# EAGLE design OV3660 3M Camera for Home Assistant V1.1 (EAGLE 6.1)
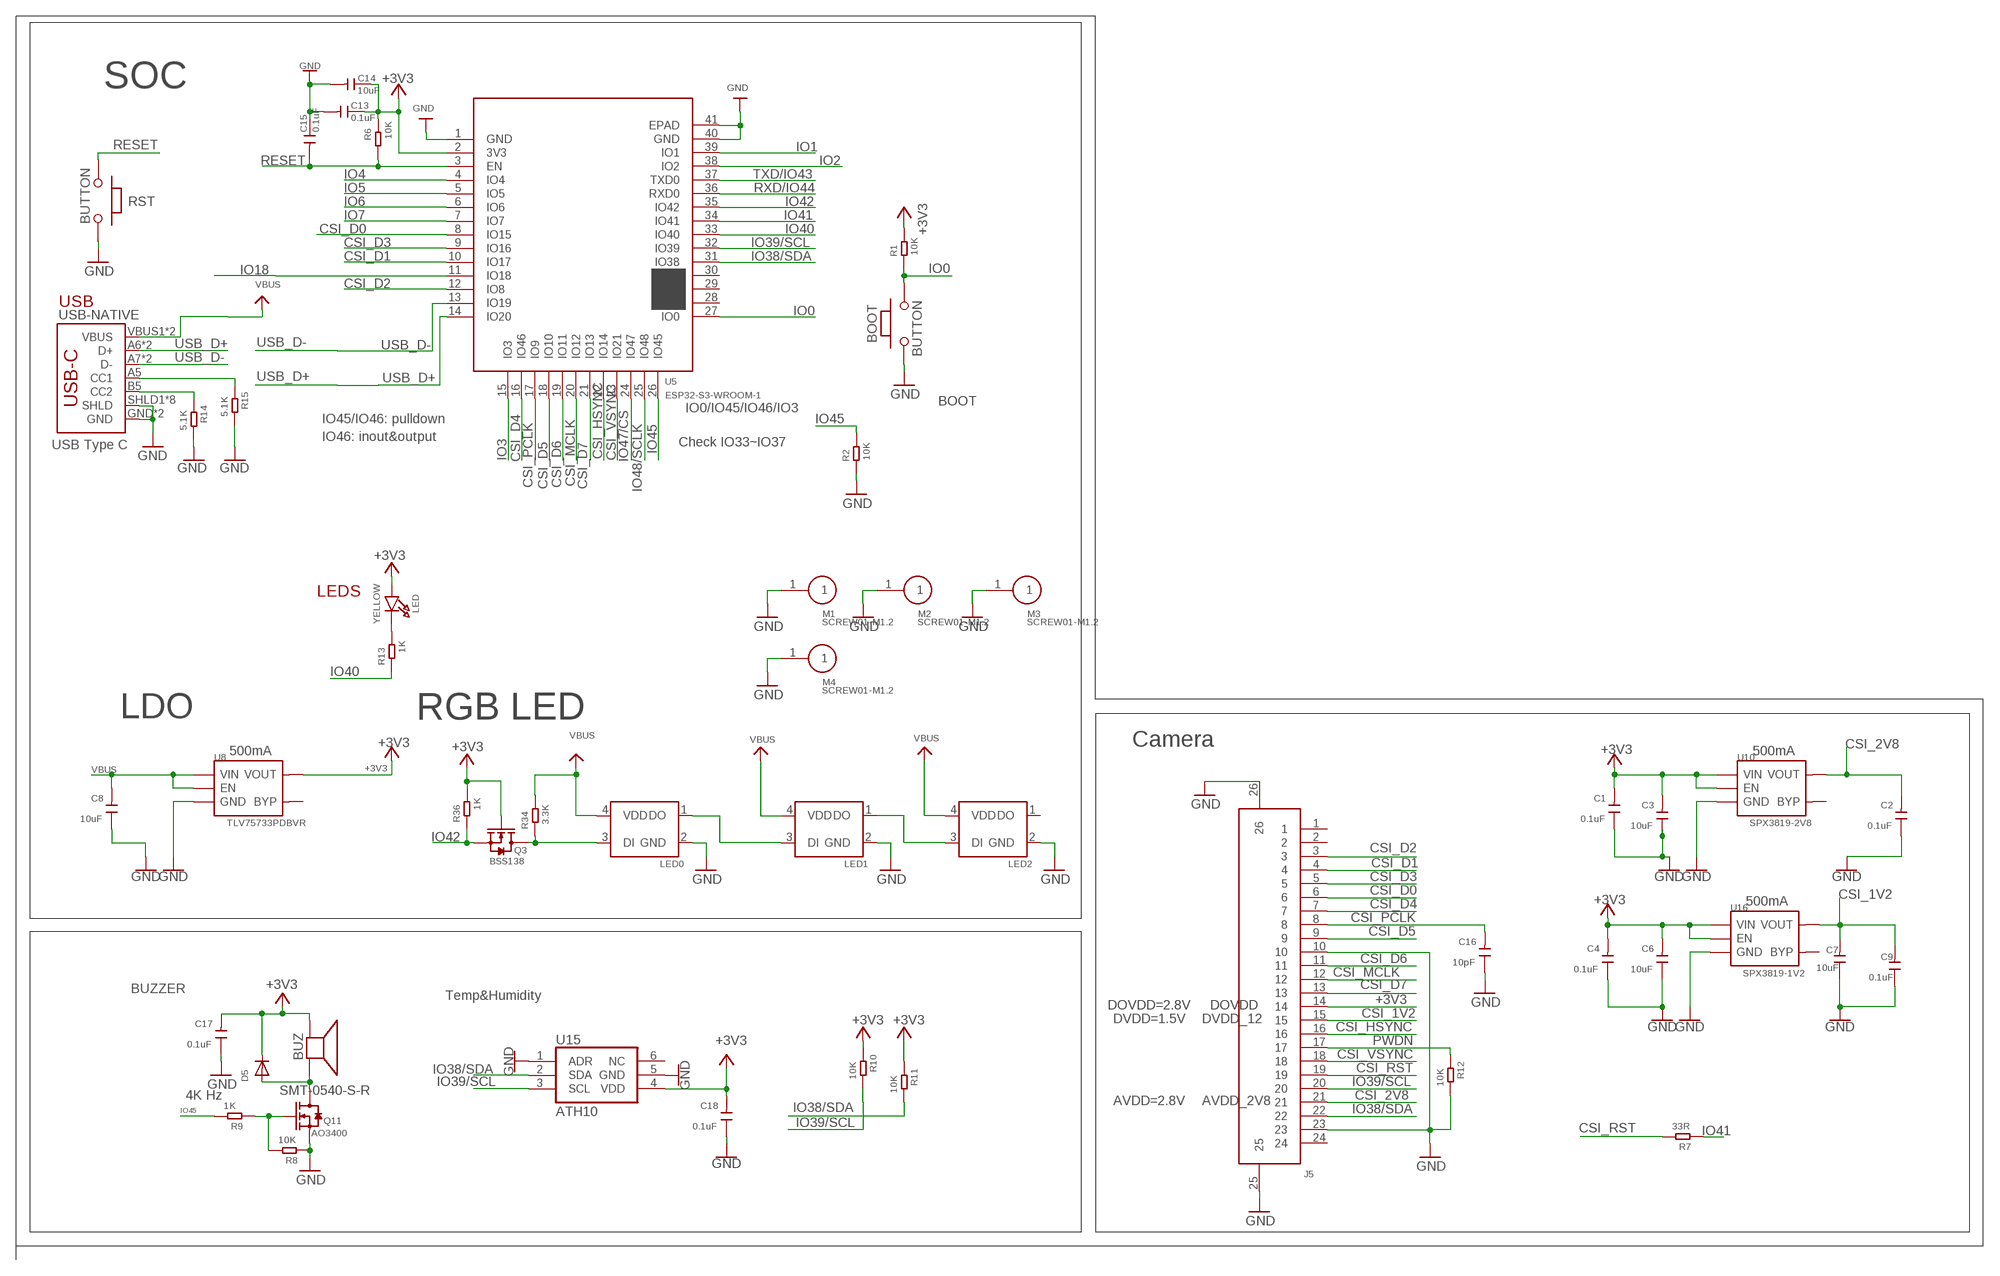
[diagram p0: schematic, sheet 1]

## Parts
BOOT  BUTTON  PB157  [157SW]
BUZ  SMT-0540-S-R  [SMT-0540-S-R]
C1  0.1uF  DISCRETE_C-0402  [DISCRETE_C0402]
C2  0.1uF  DISCRETE_C-0402  [DISCRETE_C0402]
C3  10uF  DISCRETE_C-0402  [DISCRETE_C0402]
C4  0.1uF  DISCRETE_C-0402  [DISCRETE_C0402]
C6  10uF  DISCRETE_C-0402  [DISCRETE_C0402]
C7  10uF  DISCRETE_C-0402  [DISCRETE_C0402]
C8  10uF  DISCRETE_C-0402  [DISCRETE_C0402]
C9  0.1uF  DISCRETE_C-0402  [DISCRETE_C0402]
C13  0.1uF  DISCRETE_C-0402  [DISCRETE_C0402]
C14  10uF  DISCRETE_C-0402  [DISCRETE_C0402]
C15  0.1uF  DISCRETE_C-0402  [DISCRETE_C0402]
C16  10pF  DISCRETE_C-0402  [DISCRETE_C0402]
C17  0.1uF  DISCRETE_C-0402  [DISCRETE_C0402]
C18  0.1uF  DISCRETE_C-0402  [DISCRETE_C0402]
D5  DIODESOD-323F  [SOD-323F]
J5  FPC-24P  [SMD26-50P-1760L450W]
LED  YELLOW  LED0805_NOOUTLINE  [CHIPLED_0805_NOOUTLINE]
LED0  WS2812B-2020  [WS2812B-2020]
LED1  WS2812B-2020  [WS2812B-2020]
LED2  WS2812B-2020  [WS2812B-2020]
M1  SCREW01-M1.2  [THD1-M1.2]
M2  SCREW01-M1.2  [THD1-M1.2]
M3  SCREW01-M1.2  [THD1-M1.2]
M4  SCREW01-M1.2  [THD1-M1.2]
Q3  BSS138  MOSFET-N'SOT23'  [SOT23@1]
Q11  AO3400  MOSFET-N'SOT23'  [SOT23@1]
R1  10K  DISCRETE_R-0402  [DISCRETE_R0402]
R2  10K  DISCRETE_R-0402  [DISCRETE_R0402]
R6  10K  DISCRETE_R-0402  [DISCRETE_R0402]
R7  33R  DISCRETE_R-0402  [DISCRETE_R0402]
R8  10K  DISCRETE_R-0402  [DISCRETE_R0402]
R9  1K  DISCRETE_R-0402  [DISCRETE_R0402]
R10  10K  DISCRETE_R-0402  [DISCRETE_R0402]
R11  10K  DISCRETE_R-0402  [DISCRETE_R0402]
R12  10K  DISCRETE_R-0402  [DISCRETE_R0402]
R13  1K  DISCRETE_R-0402  [DISCRETE_R0402]
R14  5.1K  DISCRETE_R-0402  [DISCRETE_R0402]
R15  5.1K  DISCRETE_R-0402  [DISCRETE_R0402]
R34  3.3K  DISCRETE_R-0402  [DISCRETE_R0402]
R36  1K  DISCRETE_R-0402  [DISCRETE_R0402]
RST  BUTTON  PB157  [157SW]
U5  ESP32-S3-WROOM-1  [ESP32-S3-WROOM-1]
U8  TLV75733PDBVR  SPX3819  [SOT23-5]
U10  SPX3819-2V8  SPX3819  [SOT23-5]
U15  ATH10  [AHT10]
U16  SPX3819-1V2  SPX3819  [SOT23-5]
USB-NATIVE  USB_C5  [USB-C-16P-5]

## Nets
+3V3: BUZ.+(-) C1.2 C3.2 C4.2 C6.2 C13.1 C14.1 C17.2 C18.2 D5.C J5.14 LED.A Q3.1(G) R1.2 R6.2 R10.1 R11.1 R36.2 U5.2(3V3) U8.5(VOUT) U10.1(VIN) U10.3(EN) U15.4(VDD) U16.1(VIN) U16.3(EN)
CSI_1V2: C7.2 C9.2 J5.15 U16.5(VOUT)
CSI_2V8: C2.2 J5.21 U10.5(VOUT)
CSI_D0: J5.6 U5.8(IO15)
CSI_D1: J5.4 U5.10(IO17)
CSI_D2: J5.3 U5.12(IO8)
CSI_D3: J5.5 U5.9(IO16)
CSI_D4: J5.7 U5.16(IO46)
CSI_D5: J5.9 U5.18(IO10)
CSI_D6: J5.11 U5.19(IO11)
CSI_D7: J5.13 U5.21(IO13)
CSI_HSYNC: J5.16 U5.22(IO14)
CSI_MCLK: J5.12 U5.20(IO12)
CSI_PCLK: C16.2 J5.8 U5.17(IO9)
CSI_RST: J5.19 R7.2
CSI_VSYNC: J5.18 U5.23(IO21)
GND: BOOT.1 C1.1 C2.1 C3.1 C4.1 C6.1 C7.1 C8.1 C9.1 C13.2 C14.2 C15.1 C16.1 C17.1 C18.1 J5.10 J5.23 J5.25 J5.26 LED0.2(GND) LED1.2(GND) LED2.2(GND) M1.1 M2.1 M3.1 M4.1 Q11.2(S) R2.1 R8.1 R12.2 R14.2 R15.2 RST.1 U5.1(GND) U5.40(GND) U5.41(EPAD) U8.2(GND) U10.2(GND) U15.1(ADR) U15.5(GND) U16.2(GND) USB-NATIVE.GND USB-NATIVE.GND2(GND) USB-NATIVE.SHLD1(SHLD) USB-NATIVE.SHLD2(SHLD) USB-NATIVE.SHLD3(SHLD) USB-NATIVE.SHLD4(SHLD) USB-NATIVE.SHLD5(SHLD) USB-NATIVE.SHLD6(SHLD) USB-NATIVE.SHLD7(SHLD) USB-NATIVE.SHLD8(SHLD)
IO0: BOOT.2 R1.1 U5.27(IO0)
IO1: U5.39(IO1)
IO2: U5.38(IO2)
IO3: U5.15(IO3)
IO4: U5.4(IO4)
IO5: U5.5(IO5)
IO6: U5.6(IO6)
IO7: U5.7(IO7)
IO18: U5.11(IO18)
IO38/SDA: J5.22 R11.2 U5.31(IO38) U15.2(SDA)
IO39/SCL: J5.20 R10.2 U5.32(IO39) U15.3(SCL)
IO40: R13.1 U5.33(IO40)
IO41: R7.1 U5.34(IO41)
IO42: Q3.2(S) R36.1 U5.35(IO42)
IO45: R2.2 R9.2 U5.26(IO45)
IO47/CS: U5.24(IO47)
IO48/SCLK: U5.25(IO48)
M-1: BUZ.-(+) D5.A Q11.3(D)
N$5: LED1.1(DO) LED2.3(DI)
N$6: LED0.1(DO) LED1.3(DI)
N$18: LED.C R13.2
N$20: LED0.3(DI) Q3.3(D) R34.1
N$25: Q11.1(G) R8.2 R9.1
N$33: R15.1 USB-NATIVE.A5(CC1)
N$34: R14.1 USB-NATIVE.B5(CC2)
PWDN: J5.17 R12.1
RESET: C15.2 R6.1 RST.2 U5.3(EN)
RXD/IO44: U5.36(RXD0)
TXD/IO43: U5.37(TXD0)
USB_D+: U5.14(IO20) USB-NATIVE.A6(D+) USB-NATIVE.B6(D+)
USB_D-: U5.13(IO19) USB-NATIVE.A7(D-) USB-NATIVE.B7(D-)
VBUS: C8.2 LED0.4(VDD) LED1.4(VDD) LED2.4(VDD) R34.2 U8.1(VIN) U8.3(EN) USB-NATIVE.VBUS1(VBUS) USB-NATIVE.VBUS2(VBUS)
Unconnected: J5.1 J5.2 J5.24 LED2.1(DO) U5.28(IO35) U5.29(IO36) U5.30(IO37) U8.4(BYP) U10.4(BYP) U15.6(NC) U16.4(BYP)

## Notes on the sheet
- SOC
- USB
- BOOT
- IO0/IO45/IO46/IO3
- IO45/IO46: pulldown
- IO46: inout&output
- USB Type C | Check IO33~IO37
- LEDS
- LDO | RGB LED
- Camera
- 500mA | 500mA
- 500mA
- BUZZER
- Temp&Humidity
- DOVDD=2.8V | DOVDD
- DVDD=1.5V | DVDD_12
- 4K Hz
- AVDD=2.8V | AVDD_2V8

## Library data of the parts
BOOT RST = MySMD:PB157
BUZ = adafruit:SMT-0540-S-R: SMT-0549-S-R Small surface-mount magnetic buzzer
C1-C4 C6-C9 C13-C18 = A9G:DISCRETE_C*: Ceramic Capacitors
D5 = adafruit2:DIODE: Diode SMADIODE - SMA Surface Mount Package 20V 1A Schottky Diode Digikey: 641-1014-6-ND DO-1N4148 - Through Hole Small Current Diode SOD-123 20V 1 A (.5mV Vf) Schottky Diode - Digikey: MBRX120TPMSCT-ND SOD-323 10V 570mA (.38mV Vf, 3ns) Schottky Diode - Digikey: ZLLS410CT-ND SOD-523 30V 30mA Schottky Diode (RB751S-40TE61) - Digikey: RB751S-40TE61CT-ND SOT23-R/W - SOT23 Package (R = Solder Paste/Reflow Ovens, W = Hand-Soldering) BAT54Film 40V 300mA - Digikey: 497-7162-1-ND
J5 = self:FPC-24P
LED = microbuilder:LED: LED 0603 - 0603 Surface Mount Package 2mA: Green LED - Low Power (3.9mcd, 2ma, 1.7Vf) - Digikey: 475-2709-2-ND Orange LED - Low Power (9.8mcd, 2ma, 1.8Vf) - Digikey: 475-1194-2-ND Red LED - Low Power (5mcd, 2ma, 1.8Vf) - Digikey: 475-1195-2-ND Yellow LED - Low Power (7mcd, 2ma, 1.8Vf) - Digikey: 475-1196-2-ND 5mA: Blue LED - Low Power (17mcd, 5ma, 2.9Vf) - Digikey: LNJ937W8CRACT-ND 0805 - 0805 Surface Mount Package 2mA: Red LED (8.8mcd, 2mA, 1.8Vf, Clear) - Low Power [Digikey: 475-2510-1-ND] Green LED (5mcd, 2mA, 1.8Vf, Clear) - Low Power [Digikey: 475-2730-1-ND] Yellow LED (11.3mcd, 2mA, 1.8Vf, Clear) - Low Power [Digikey: 475-2555-1-ND] 20mA: Red LED (104mcd, 20mA, Diffused) - LS R976 [Digikey: 475-1278-6-ND] Red LED (12mcd, 20mA, 2.0Vf, Clear) - APT2012EC [Digikey: 754-1128-1-ND] Green LED (15mcd, 20mA, 2.2Vf, Clear) - APT2012GC [Digikey: 754-1131-1-ND] Orange LED (160mcd, 20mA, 2.1Vf, Clear) - APT2012SECK [Digikey: 754-1130-1-ND] 1206 - 1206 Surface Mount Package Green LED (26mcd, 20mA, Diffused) - LG N971 [Digikey: 475-1407-6-ND] Red LED (15mcd, 20mA, Diffused) - LH N974 [Digikey: 475-1416-6-ND] Cree - Cree High-Power Surface Mount LEDs XPEBWT-L1-0000-00D50 - White 111lm 350mA 2.9Vf 6200K 110° XTEAWT-00-0000-00000LEE3 - White 114lm 350mA 2.85Vf 5000K 115° Everlight - Everlight 45-21 Series Surface Mount LEDs 45-21/QK2C-B2832AC2CB2/2T - Warm White 2000mcd 20mA 3.25Vf 3050K 120° 45-21/LK2C-B38452C4CB2/2T - Nuetral White 2000mcd 20mA 3.25Vf 4150K 120° 45-21/LK2C-B50634C6CB2/2T - Cold White 2200mcd 20mA 3.25Vf 5650K 120° PLCC2 Reverse Mount LS T77K-J1L2-1-0-2-R18-Z - Red 11.25mcd 2mA 1.8Vf 630nm 120° LO T77K-L1M2-24-Z - Orange 19.6mcd 2mA 1.8Vf 606nm 120° LY T77K-K2M1-26-Z - Yellow 15.7mcd 2mA 1.8Vf 587nm 120°
LED0 LED1 LED2 = user:WS2812B-2020
M1-M4 = user:SCREW01-M1.2
Q3 Q11 = Discrete:MOSFET-N: IRLL014: http://www.vishay.com/docs/91319/sihll014.pdf
R1 R2 R6-R15 R34 R36 = A9G:DISCRETE_R*
U5 = self:ESP32-S3-WROOM-1
U8 U10 U16 = IC:SPX3819
U15 = Makerfabs-Peter:ATH10
USB-NATIVE = USBC:USB_C: USB Type C 16Pin Connector Super Speed pins not available on the 16-pin purely SMD connector so this part is best for USB 2.0 implementations. D1 and D2 are tied together enabling D+/- no matter which way the cable is plugged into the connector. The two channel configuration pins (CC1/2) are exposed. These are normally connected to ground via 5.1k resistors but can be reconfigured for high current/high power applications.

## Net classes
0 default: drill 0.305 mm
2 gnd: width 0.305 mm, drill 0.559 mm, clearance 0.254 mm
3 usbvcc: width 0.508 mm, drill 0.61 mm, clearance 0.254 mm
4 USBpair: width 0.254 mm, drill 0.406 mm, clearance 0.406 mm

## Board
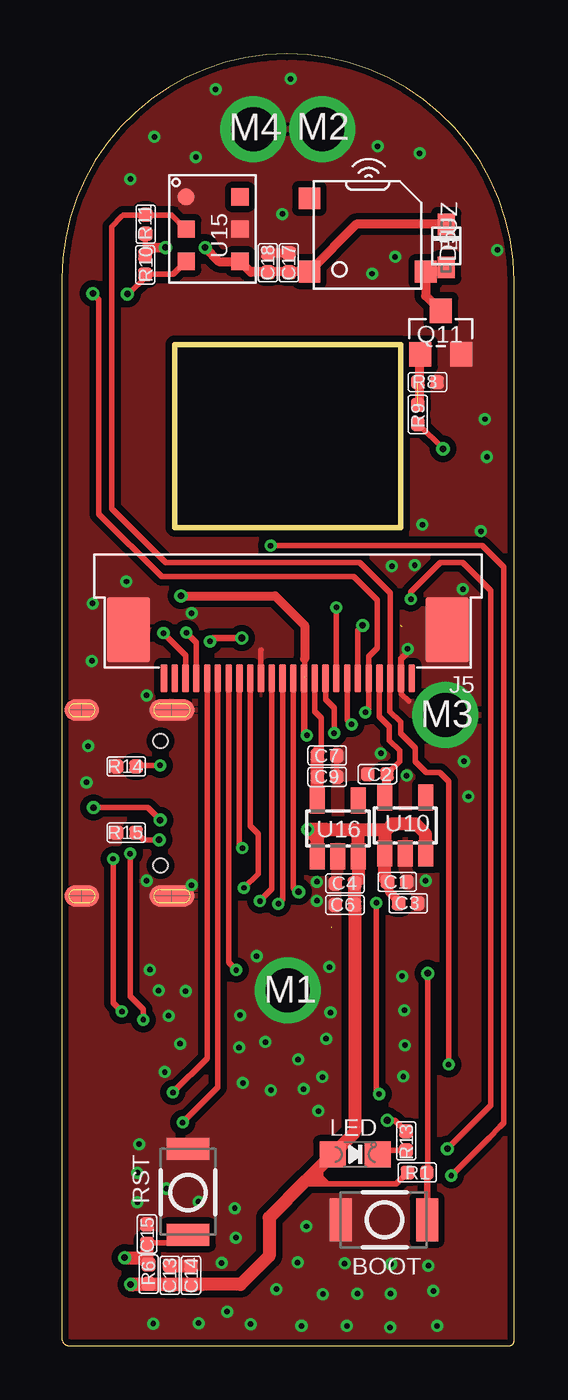
[diagram p1: board, top side]
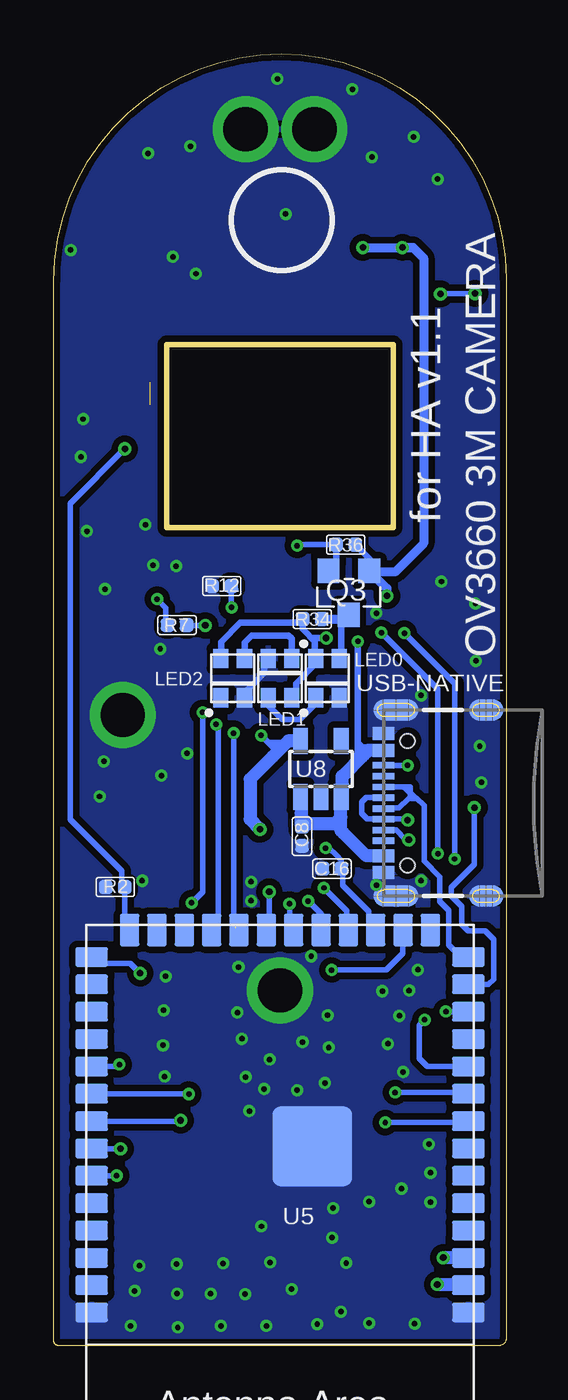
[diagram p2: board, bottom side, seen from below]

Size 21 x 60 mm. Coordinates in mm from the lower left corner, seen from the top.
Outline: 0,49.55 0,0.34 arc90 0.34,0 20.79,0 arc90 21,0.21 21,49.45 arc90 10.45,60 arc90 0,49.55
Outline: 15.75,46.5 10.5,46.5 5.25,46.5 5.25,38 15.75,38 15.75,46.5
Copper layers (1*16): Top 0.035mm / dielectric 1.5mm / Bottom 0.035mm
Design rules: minimum track width 6mil, minimum drill 8mil, track to track 6mil, track to pad 6mil, pad to pad 6mil, via to via 6mil, smd to smd 0mil, copper to edge 10mil, drill to drill 10mil, minimum pad ring 10mil, minimum via ring 6mil, stop-mask expansion 2mil, vias tented up to drill 30mil, thermal gap 0mil

### Footprints (pad centres in the part's own frame; a part is rotated, then mirrored left to right if it is on the bottom)
157SW = smd 1.016 x 1.981: 1 0,0; 2 4,0
SMT-0540-S-R = smd 1 x 1: + 1.7,-2.7; - 1.7,2.7; M -1.7,-2.7
DISCRETE_C0402 = smd 0.635 x 0.635: 1 -0.445,0; 2 0.445,0
SOD-323F = smd 1 x 0.8: A -1,0; C 1,0
SMD26-50P-1760L450W = smd 0.3 x 1.3: 1 5.75,0; 2 5.25,0; 3 4.75,0; 4 4.25,0; 5 3.75,0; 6 3.25,0; 7 2.75,0; 8 2.25,0; 9 1.75,0; 10 1.25,0; 11 0.75,0; 12 0.25,0; 13 -0.25,0; 14 -0.75,0; 15 -1.25,0; 16 -1.75,0; 17 -2.25,0; 18 -2.75,0; 19 -3.25,0; 20 -3.75,0; 21 -4.25,0; 22 -4.75,0; 23 -5.25,0; 24 -5.75,0 | smd 2 x 3: 25 -7.4,-2.25; 26 7.4,-2.25
CHIPLED_0805_NOOUTLINE = smd 1.2 x 1.2: A 0,-1.05; C 0,1.05
WS2812B-2020 = smd 0.9 x 0.7: 1 -0.915,0.55; 2 -0.915,-0.55; 3 0.915,-0.55; 4 0.915,0.55
THD1-M1.2 = drill 2.05 pad 2.5: 1 0,0
SOT23@1 = smd 1.016 x 1.143: 1 -0.95,-1.016; 2 0.95,-1.016; 3 0,1.016
DISCRETE_R0402 = smd 0.635 x 0.635: 1 -0.445,0; 2 0.445,0
ESP32-S3-WROOM-1 = smd 1.5 x 0.9: 1 -8.75,5.26; 2 -8.75,3.99; 3 -8.75,2.72; 4 -8.75,1.45; 5 -8.75,0.18; 6 -8.75,-1.09; 7 -8.75,-2.36; 8 -8.75,-3.63; 9 -8.75,-4.9; 10 -8.75,-6.17; 11 -8.75,-7.44; 12 -8.75,-8.71; 13 -8.75,-9.98; 14 -8.75,-11.25; 27 8.75,-11.25; 28 8.75,-9.98; 29 8.75,-8.71; 30 8.75,-7.44; 31 8.75,-6.17; 32 8.75,-4.9; 33 8.75,-3.63; 34 8.75,-2.36; 35 8.75,-1.09; 36 8.75,0.18; 37 8.75,1.45; 38 8.75,2.72; 39 8.75,3.99; 40 8.75,5.26 | smd 0.9 x 1.5: 15 -6.985,-12.5; 16 -5.715,-12.5; 17 -4.445,-12.5; 18 -3.175,-12.5; 19 -1.905,-12.5; 20 -0.635,-12.5; 21 0.635,-12.5; 22 1.905,-12.5; 23 3.175,-12.5; 24 4.445,-12.5; 25 5.715,-12.5; 26 6.985,-12.5 | smd 3.7 x 3.7: 41 -1.5,-2.46
SOT23-5 = smd 0.69 x 1.2: 1 -0.95,-1.3; 2 0,-1.3; 3 0.95,-1.3; 4 0.95,1.3; 5 -0.95,1.3
AHT10 = smd 0.8 x 0.8: 1 0.777,3.985; 2 0.777,2.485; 3 0.777,0.985; 4 3.277,0.985; 5 3.277,2.485; 6 3.277,3.985
USB-C-16P-5 = smd 0.3 x 1: A5 -1.25,-0.34; A6 -0.25,-0.34; A7 0.25,-0.34; A8 1.25,-0.34; B5 1.75,-0.34; B6 0.75,-0.34; B7 -0.75,-0.34; B8 -1.75,-0.34 | smd 0.6 x 1: GND -3.225,-0.34; GND2 3.225,-0.34; VBUS1 -2.45,-0.34; VBUS2 2.45,-0.34 | smd 1 x 2.1: SHLD1 -4.32,-0.915; SHLD2 4.32,-0.915 | smd 1 x 2.1 bottom: SHLD3 -4.32,-0.915; SHLD4 4.32,-0.915 | smd 1 x 1.6: SHLD5 -4.32,-5.095; SHLD8 4.32,-5.095 | smd 1 x 1.6 bottom: SHLD6 -4.32,-5.095; SHLD7 4.32,-5.095 | hole 0.65: -2.89,-1.445; 2.89,-1.445

### Placement (x,y rotation side)
BOOT  12.96,5.84 0 top
BUZ  14.2,51.58 270 top
C1  15.58,21.55 180 top
C2  14.66,26.54 0 top
C3  16.09,20.55 180 top
C4  13.15,21.47 0 top
C6  13.15,20.47 0 top
C7  12.32,27.41 180 top
C8  9.48,23.66 90 bottom
C9  12.32,26.42 180 top
C13  5.02,3.27 90 top
C14  6,3.27 90 top
C15  3.96,5.19 270 top
C16  8.09,22.15 0 bottom
C17  10.55,50.3 270 top
C18  9.57,50.3 270 top
D5  17.85,51.08 90 top
J5  10.5,31 180 top
LED  13.63,8.88 270 top
LED0  8.3,31 90 bottom
LED1  10.5,31 270 bottom
LED2  12.7,31 90 bottom
M1  10.5,16.5 0 top
M2  12.1,56.5 0 top
M3  17.8,29.3 0 top
M4  8.9,56.5 0 top
Q3  7.3,34.97 180 bottom
Q11  17.6,47.05 0 top
R1  16.5,8.04 180 top
R2  18.15,21.3 0 bottom
R6  4.03,3.32 270 top
R7  15.28,33.47 0 bottom
R8  16.98,44.75 180 top
R9  16.53,43.25 270 top
R10  3.87,50.2 270 top
R11  3.9,52.09 90 top
R12  13.2,35.28 180 bottom
R13  15.99,9.51 270 top
R14  3,26.9 180 top
R15  3,23.83 180 top
R34  9.01,33.75 180 bottom
R36  7.45,37.21 0 bottom
RST  5.86,9.15 270 top
U5  10.5,6.8 180 bottom
U8  8.6,26.79 0 bottom
U10  15.95,24.15 0 top
U15  5,49.37 0 top
U16  12.82,24.03 0 top
USB-NATIVE  6.03,25.2 90 bottom

### Tracks (layer width: path | path; a pad name or v marks a point on that pad's centre or on a via)
+3V3  (via drill 0.25, 0.3)  (1 unrouted)
  Top 0.254: 11.28,31.03 J5.14 | R1.2 15.53,7.52 12.32,7.52 | 12.32,7.52 12.24,7.52 12.01,7.52 | 12.01,7.52 11.81,7.52 | 11.81,7.52 11.43,7.52 11.35,7.59 11.35,7.67 | 11.81,8 11.81,7.52 | 12.01,8 12.01,7.52 | LED.A 13.56,9.87 13.56,9.91 | 13.56,9.91 13.54,9.91 13.56,9.91 | 13.56,9.91 13.59,9.93 13.61,9.93 13.59,9.91 | C1.2 15.21,21.55 15.21,21.54 | 11.28,31.9 11.28,31.06 | 11.91,7.92 12.32,7.52 | R10.1 3.87,51.62 R11.1
  Top 0.305: J5.14 11.25,28.48 v11.38,28.35
  Top 0.406: C3.2 15.54,20.64 15.54,20.75 15.21,21.08 15.21,21.54 | v6.66,51 7.3,50.36 U15.4 | v5.54,34.82 9.91,34.82 11.28,33.45 11.28,31.9 | v4.82,51 4.8,51 | v4.82,51 3.99,51 | R10.1 4.23,51 v4.82,51 | U15.4 | U15.4 | D5.C 13.67,52.08 11.53,49.94 11.53,49.91 BUZ.+ | BUZ.+ 8.75,49.88 U15.4 | BUZ.+ 10.57,49.88 C17.2 | C18.2 8.78,49.85 U15.4
  Top 0.61: U16.1 11.87,23.34 | 11.87,23.34 11.87,23.66 12.19,23.98 | 12.19,23.98 12.27,23.98 | 12.27,23.98 13.49,23.98 13.74,23.72 13.74,22.75 U16.3 13.77,21.65 C4.2 C6.2 13.59,9.91 11.35,7.67 9.63,5.94 9.63,4.17 8.31,2.85 6.53,2.85 3.89,2.85 | U10.3 16.9,23.77 16.43,24.23 15.37,24.23 15.27,24.13 | 15.27,24.13 15.01,23.88 15.01,22.87 arc-90 U10.1 15,21.68 C1.2 | 12.19,23.98 12.27,23.98 | 12.27,23.98 15.11,23.98 15.27,24.13 | 11.87,23.34 11.87,23.54 v11.43,23.98 12.27,23.98 | 3.89,2.85 v3.2,2.85 3.23,2.82 3.28,2.82 C13.1 | C13.1 C14.1 C13.1 | R6.2 3.92,2.88 3.89,2.85
  Bottom 0.254: 2.03,2.9 1.84,2.9 U5.2 | 6.4,35.94 6.39,35.94 Q3.1
  Bottom 0.305: Q3.1 6.35,36.55 R36.2 | v11.38,28.35 11.02,27.99 | 11.02,27.99 10.77,27.74 10.64,27.74 | 10.11,28.09 10.21,27.99 11.02,27.99
  Bottom 0.406: 3.83,50.52 3.83,37.26 5.16,35.94 6.4,35.94 | Q3.1 5.54,35.17 v5.54,34.82 | 3.83,50.52 4.29,50.98 4.72,50.98 | 4.72,50.98 4.8,50.98 v4.82,50.99 v4.82,51 | 3.83,50.52 4.32,51 4.78,51 | 4.78,51 4.8,51 4.78,50.98 4.72,50.98 | v6.66,51 v4.83,51 | v4.83,51 4.78,51 | 4.78,51 v4.83,51
  Bottom 0.61: U8.5 10.11,28.09 10.85,27.36 11.89,26.31 11.89,24.46 11.43,24 v11.43,23.98 11.46,23.98 | v3.2,2.85 2.06,2.85 2.06,2.87 2.03,2.9
CSI_1V2
  Top 0.254: 11.89,27.56 12.04,27.71 12.04,29.16 11.75,29.45 J5.15 | 11.88,27.44 arc-90 11.86,27.46 11.86,27.51 arc90 11.87,27.52
  Top 0.61: 11.89,27.53 11.87,27.52 11.89,27.53 | 11.89,27.53 11.89,27.56 | U16.5 11.87,26.62 | 11.87,26.62 11.87,27.45 11.86,27.46 11.88,27.44 C7.2 | C9.2 11.88,26.61 11.87,26.62
CSI_2V8
  Top 0.254: J5.21 14.75,29.22 15.21,28.75 15.21,28.12 15.7,27.64 15.7,27.14 C2.2 15.21,26.66
  Top 0.406: U10.5 15.1,25.56 C2.2
CSI_D0  (via drill 0.25)
  Top 0.254: J5.6 7.25,12 v5.61,10.36
  Bottom 0.254: v5.61,10.36 1.83,10.36 1.82,10.36 U5.8
CSI_D1  (via drill 0.25)
  Top 0.254: v3.79,15.14 3.79,15.62 3.17,16.23 v3.17,22.86 | v5.79,33.12 6.25,32.66 J5.4
  Bottom 0.254: U5.10 3.67,12.97 4.04,13.34 4.04,14.88 v3.79,15.14 | v3.17,22.86 3.17,30.5 v5.79,33.12
CSI_D2  (via drill 0.25)
  Top 0.254: v2.79,15.52 2.39,15.93 v2.39,22.61 | v4.72,33.1 5.77,32.05 5.77,30.99 5.74,31.01 J5.3 5.77,30.98 5.77,30.96
  Bottom 0.254: U5.12 v2.79,15.51 v2.79,15.52 | v2.39,22.61 2.39,30.76 v4.72,33.1
CSI_D3  (via drill 0.25)
  Top 0.254: J5.5 6.75,13.35 v5.16,11.76
  Bottom 0.254: v5.16,11.76 1.81,11.76 U5.9
CSI_D4  (via drill 0.25)
  Top 0.254: J5.7 7.75,17.8 v8.1,17.45
  Bottom 0.254: 4.8,18.21 4.8,19.28 | 4.8,19.28 | 4.8,19.28 U5.16 | v8.1,17.45 5.56,17.45 4.8,18.21 | 4.8,18.21 4.8,19.25 4.78,19.28 4.78,19.25 4.8,19.28 | 4.8,19.28 | 4.8,19.28 U5.16 4.83,19.28 4.8,19.28 | 4.8,19.28 4.83,19.3 4.81,19.28 4.8,19.28
CSI_D5  (via drill 0.25)
  Top 0.254: J5.9 8.75,24.14 9.12,23.77 9.12,21.92 v8.46,21.26
  Bottom 0.254: 7.52,19.49 U5.18 | 7.59,19.23 7.52,19.3 U5.18 | 7.62,19.3 U5.18 | v8.46,21.26 7.39,20.19 7.39,19.41 7.33,19.34 U5.18
CSI_D6  (via drill 0.25)
  Top 0.254: J5.11 9.75,22.07 9.75,21.2 v9.2,20.65
  Bottom 0.254: 8.69,19.28 8.61,19.2 8.61,19.28 | 8.61,19.28 8.61,19.41 | 8.61,19.28 U5.19 8.6,20.05 v9.2,20.65
CSI_D7  (via drill 0.3)
  Top 0.254: v11,21.08 arc-90 10.74,21.34 10.74,30.99 J5.13
  Bottom 0.254: U5.21 11,19.44 v11,21.08
CSI_HSYNC  (via drill 0.25)  (1 unrouted)
  Top 0.254: J5.16 12.25,30.02 12.6,29.67 12.65,29.62 v12.65,28.45
  Bottom 0.254: 12.24,19.33 12.37,19.33 12.37,19.3 U5.22 12.55,19.44 | v12.65,28.45 12.65,19.51 arc-90 12.55,19.41
CSI_MCLK  (via drill 0.25)
  Top 0.254: J5.12 10.25,21.43 10.25,21.01 10.25,20.71 v10.06,20.52
  Bottom 0.254: 10.01,19.51 9.96,19.46 9.96,19.39 U5.20 | 9.8,19.66 9.8,19.43 9.83,19.41 9.83,19.34 U5.20 | v10.06,20.52 10.06,19.63 10.01,19.58 10.01,19.44 U5.20
CSI_PCLK  (via drill 0.25)
  Top 0.254: J5.8 8.25,23.54 8.25,23.25 v8.38,23.11
  Bottom 0.254: 7.77,22.28 C16.2 | C16.2 7.64,22.22 7.67,22.25 | 7.67,22.25 7.7,22.28 | 7.77,22.35 7.7,22.28 | 7.7,22.28 7.67,22.25 | 7.67,22.25 7.72,22.25 7.72,22.28 | 7.72,22.28 7.7,22.3 7.72,22.28 | 7.7,22.28 7.72,22.28 | 7.77,22.2 7.72,22.15 C16.2 | U5.17 6.05,19.57 6.38,19.89 6.38,20.17 7.59,21.39 7.59,22.15 7.62,22.17 C16.2 | v8.38,23.11 8.23,23.11 7.87,22.76 7.64,22.53 C16.2
CSI_RST  (via drill 0.3)
  Top 0.254: J5.19 13.75,33.23 v13.97,33.45
  Bottom 0.254: v13.97,33.45 14.07,33.45 14.91,33.45 arc90 14.89,33.47 R7.2
CSI_VSYNC  (via drill 0.25)
  Top 0.254: J5.18 13.25,29.07 v13.46,28.85
  Bottom 0.254: U5.23 13.68,19.55 13.36,19.86 13.36,28.83 13.44,28.83 arc90 v13.46,28.85
GND  (via drill 0.25)
  Top 0.254: C7.1 C9.1 | J5.23 15.75,31.9 16.08,32.23 16.08,32.21 15.77,31.9 15.77,30.28 16.1,29.95 | J5.10 9.25,32.29 9.27,32.31
  Top 0.406: C17.1 9.62,50.74 | 9.62,50.74 9.6,50.72 C18.1 | C18.1 9.62,50.74
  Top 0.61: C13.2 C14.2
  Bottom 0.305: LED1.2 11.23,31.74 11.23,31.24 12.15,30.32 LED2.2
  other vias: 6.23,55.2 15.81,17.15 10.24,52.56 12.43,17.58 11.23,11.92 4.1,17.46 5.75,16.47 4.78,12.71 5.49,14.03 4.96,15.32 4.5,16.49 16.9,21.6 16.01,26.47 6.03,34.02 3,35.49 7.42,3.84 8.08,5.01 8.03,6.38 6.36,6.69 4.86,7.3 3.94,21.6 11.84,20.66 6.03,21.39 1.4,31.81 1.43,34.47 3.94,30.21 16.06,32.37 14.82,27.52 11.84,21.55 9.05,18.09 8.29,15.35 8.41,12.2 9.71,11.87 12.48,15.48 9.46,14.1 10.98,13.29 12.1,12.48 15.91,15.58 15.86,12.5 15.93,13.95 12.28,14.26 8.24,13.85 3.59,9.35 3.51,6.66 3.51,8.03 4.25,1.02 6.36,1.05 8.77,1 11.13,0.92 13.24,0.92 15.25,0.84 17.43,0.92 17.25,2.55 17.02,3.72 9.96,2.62 11.36,5.54 10.95,3.87 13.14,3.82 15.3,3.79 15.27,2.42 12.12,2.39 13.72,2.42 7.68,1.58 11.92,10.9 18.63,35.13 18.68,27.13 18.88,25.51 1.23,27.85 1.15,26.17 19.46,37.83 19.64,43.03 19.74,41.28 4.3,56.14 7.14,58.35 10.62,58.83 16.62,55.38 14.66,55.71 3.18,54.19 15.32,36.2 16.75,38.13 14.41,49.79 15.48,50.58 20.23,50.88 16.39,36.25
  pour Bottom (isolate 0.305, rank 6): -3.81,-3.81 23,-3.81 23,62 -3.81,62
  pour Top (isolate 0.305, rank 6): -2.54,-2.54 22,-2.54 22,61 -2.54,61
IO0  (via drill 0.3)
  Top 0.254: v16.99,17.3 16.99,5.99 | 16.99,5.99 16.99,5.74 | BOOT.2 16.99,5.88 16.99,5.99 | 16.99,5.99 16.92,5.99 16.95,6.02 R1.1
  Bottom 0.254: U5.27 18.99,18.05 18.69,17.75 17.45,17.75 v16.99,17.3
IO38/SDA  (via drill 0.25)
  Top 0.254: v17.96,13.06 17.96,25.93 17.96,25.96 17.96,26.21 17.55,26.62 17.42,26.62 16.92,26.62 16.41,27.13 16.41,27.76 15.75,28.42 15.75,28.96 15.24,29.46 15.24,30.02 15.24,30.91 J5.22 15.25,34.97 13.84,36.37 4.83,36.37 2.31,38.89 2.31,51.97 2.77,52.43 2.85,52.51 3.91,52.51 | 3.91,52.51 5.1,52.51 5.74,51.87 5.75,51.86 U15.2 | R11.2 3.91,52.51
  Bottom 0.254: U5.31 18.04,12.97 v17.96,13.06
IO39/SCL  (via drill 0.25, 0.3)
  Top 0.254: v14.1,29.41 14.25,29.57 J5.20 14.25,32.01 14.66,32.41 14.66,34.62 13.56,35.71 4.65,35.71 1.73,38.63 1.73,48.59 v1.45,48.87 | v14.61,20.57 14.61,13.23 14.61,11.81 v14.73,11.68 | U15.3 5.77,50.35 5.77,50.34 5.18,49.76 4.66,49.76 4.45,49.76 R10.2 3.92,49.71 3.96,49.71 3.1,48.84 v3.05,48.84
  Bottom 0.254: v14.73,11.68 19.18,11.68 | 19.18,11.68 19.2,11.66 | U5.32 19.19,11.7 19.18,11.68 | v3.05,48.84 3.02,48.87 v1.45,48.87 | v14.1,29.41 14.1,21.08 v14.61,20.57 14.53,20.57
IO40  (via drill 0.3)
  Top 0.254: v15.11,10.46 15.47,10.46 16,9.93 | 16,9.93 16.03,9.91 16,9.93
  Top 0.305: 16,9.93 16,9.95 R13.1
  Bottom 0.254: U5.33 15.15,10.43 v15.11,10.46
IO41  (via drill 0.25, 0.3)  (1 unrouted)
  Top 0.254: v17.91,9.14 19.91,11.15 19.91,35.08 18.62,36.37 17.58,36.37 16.2,35 v16.2,34.67 | v16.2,34.67 16.2,34.65 v16.2,34.67
  Bottom 0.254: v17.91,9.14 19.23,9.14 U5.34 | 15.72,33.43 15.75,33.45 15.74,33.45 R7.1 | v16.2,34.67 15.8,34.27 15.8,33.38
IO42  (via drill 0.25)
  Top 0.254: v18.09,7.9 19.84,9.65 20.34,10.16 20.52,10.34 20.52,36.17 19.53,37.16 17.68,37.16 v9.7,37.16
  Bottom 0.254: U5.35 v18.09,7.89 v18.09,7.9 | v9.7,37.16 9.66,37.2 R36.1
  Bottom 0.305: R36.1 7.89,36.34 Q3.2
IO45  (via drill 0.3)
  Top 0.254: v17.7,41.66 16.55,42.81 R9.2
  Bottom 0.254: U5.26 17.7,19.52 R2.2 17.86,21.45 17.86,22.05 20.24,24.43 20.24,39.09 20.24,39.12 v17.7,41.66
M-1
  Top 0.406: D5.A 17.76,49.99 17.73,49.99 17.62,49.88 BUZ.- 16.9,48.77 Q11.3
N$5
  Bottom 0.305: LED2.3 12.14,31.92 12.14,32.66 11.81,32.99 10.11,32.99 9.95,32.84 LED1.1
N$6
  Bottom 0.254: LED0.1 8.85,29.81 8.66,29.81 8.66,29.87 | LED1.3 11.07,30.06 11.07,30.05 11.05,30.02 11.05,29.74 10.49,29.18 10.39,29.08 9.58,29.08 8.89,29.77 8.89,30 8.81,30.07 8.84,30.07 LED0.1 | 8.64,29.87 8.85,29.87 LED0.1
N$18
  Top 0.254: R13.2 14.86,9.07 LED.C
N$20
  Bottom 0.305: Q3.3 7.65,33.6 7.65,32.01 LED0.3
  Bottom 0.406: R34.1 7.62,33.75 7.62,33.78 7.52,33.78 7.3,33.78 Q3.3
N$25  (1 unrouted)
  Top 0.406: R9.1 16.61,43.7 16.61,46.13 16.65,46.13 Q11.1
N$33  (via drill 0.3)
  Top 0.254: 3.35,23.95 3.44,23.86 | 3.44,23.86 3.8,23.5 v4.52,23.5 | R15.1 3.43,23.82 | 3.43,23.82 | 3.43,23.82 R15.1 3.44,23.86
  Bottom 0.254: USB-NATIVE.A5 5.1,23.95 4.67,23.52 4.52,23.52 4.5,23.5 v4.52,23.5
N$34  (via drill 0.25)
  Top 0.254: v4.57,26.95 3.48,26.95 3.43,26.9 R14.1
  Bottom 0.254: USB-NATIVE.B5 v4.57,26.95
PWDN  (via drill 0.25)
  Top 0.254: J5.17 arc90 J5.17 v12.75,34.29
  Bottom 0.254: v12.75,34.29 v12.76,34.3 R12.1
RESET  (via drill 0.3)
  Top 0.254: RST.2 5.49,4.78 4.01,4.78 3.98,4.74 C15.2
  Top 0.61: v2.92,4.09 3.71,4.09 R6.1 3.96,3.84 C15.2
  Bottom 0.61: U5.3 v2.91,4.08 v2.92,4.09
USB_D+
  Bottom 0.254: 3.81,24.59 3.81,24.49 | 3.81,24.49 3.81,22.78 3.81,22.5 3.07,21.77 3.07,21.61 3.07,20.62 2.67,20.22 2.67,18.62 2.01,17.96 1.83,17.96 U5.14 | USB-NATIVE.A6 5.67,24.97 5.11,24.97 4.98,24.97 4.52,25.43 4.45,25.43 | 4.45,25.43 4.19,25.43 | 4.19,25.43 4.14,25.43 3.81,25.09 3.81,24.49 | USB-NATIVE.B6 4.46,25.95 4.45,25.93 4.45,25.43 | U5.14 1.7,18.09 | U5.14 | 4.67,25.91 4.19,25.43
USB_D-  (via drill 0.3)
  Top 0.254: v1.47,24.99 3.99,24.99 v4.57,24.41
  Bottom 0.254: 5.71,24.46 5.79,24.46 6.45,24.46 6.71,24.71 6.71,25.25 6.5,25.45 5.71,25.45 USB-NATIVE.A7 | U5.13 0.82,16.78 0.58,17.02 0.58,18.87 0.96,19.25 1.75,19.25 2.06,19.56 2.06,20.4 2.54,20.88 2.54,21.29 1.47,22.35 v1.47,24.99 | v4.57,24.41 4.62,24.46 USB-NATIVE.B7 | USB-NATIVE.B7 5.71,24.46 | 5.71,24.46 5.71,24.45 USB-NATIVE.B7 | USB-NATIVE.B7 5.71,24.46
VBUS  (via drill 0.25, 0.3)
  Top 0.305: v8.36,32.87 7.04,32.87 v6.88,32.72
  Bottom 0.254: 9.75,33.58 9.47,33.58 | 7.67,23.93 7.67,24.11 | 8.89,31.88 LED0.4 8.86,31.93 8.87,31.93 | 7.67,25.48 7.66,25.48 U8.3 | 6.17,27.81 6.68,27.81 6.88,28.02 | 9.45,33.66 9.45,33.68 | 9.45,33.68 arc90 9.4,33.73 | 9.45,33.68 arc90 9.45,33.68 9.45,33.73 arc-90 9.47,33.76 R34.2 arc90 R34.2
  Bottom 0.305: LED1.4 9.75,30.09 9.75,30.76 8.87,31.65 8.87,31.93 | LED2.4 13.23,31.93 13.23,32.69 12.34,33.58 9.91,33.58 9.75,33.58 | 9.04,32.87 9.25,33.07 9.45,33.27 9.45,33.58 | 9.04,32.87 8.89,32.72 8.89,31.88 | v6.88,32.72 6.88,28.02 6.88,27.56 6.76,27.43 | 9.45,33.58 9.45,33.66 | 9.47,33.58 9.45,33.58 | v8.36,32.87 9.04,32.87 | 9.22,24.26 9.37,24.11 9.6,24.11 9.68,24.18 9.68,24.59 9.63,24.54 9.63,24.18 9.55,24.1 C8.2 9.32,24.26 9.22,24.26 | 9.22,24.26 9.2,24.28 | 7.62,26.01 7.62,25.91
  Bottom 0.61: USB-NATIVE.VBUS1 6.49,22.75 7.54,23.8 7.67,23.93 7.67,24.54 | 7.67,24.54 7.67,25.3 | 7.67,25.3 7.67,25.48 | 7.62,26.01 7.62,25.91 | 7.62,25.91 7.62,25.35 7.67,25.3 | USB-NATIVE.VBUS2 6.41,27.65 6.49,27.57 | 6.49,27.57 6.6,27.46 | 6.6,27.46 6.71,27.36 6.76,27.3 | U8.1 9.53,25.47 9.53,24.74 9.53,24.56 9.22,24.26 7.95,24.26 7.67,24.54 | 7.62,26.01 7.62,26.12 7.62,26.44 6.6,27.46 | 7.62,26.01 7.62,25.91 | 7.62,25.91 7.62,25.07 | 6.76,27.43 arc90 6.55,27.64 arc-90 6.49,27.57

### Text on the board
tPlace: BUZ
bPlace: OV3660 3M CAMERA | for HA v1.1